# EAGLE design combined_breakout (EAGLE 6.5.0)
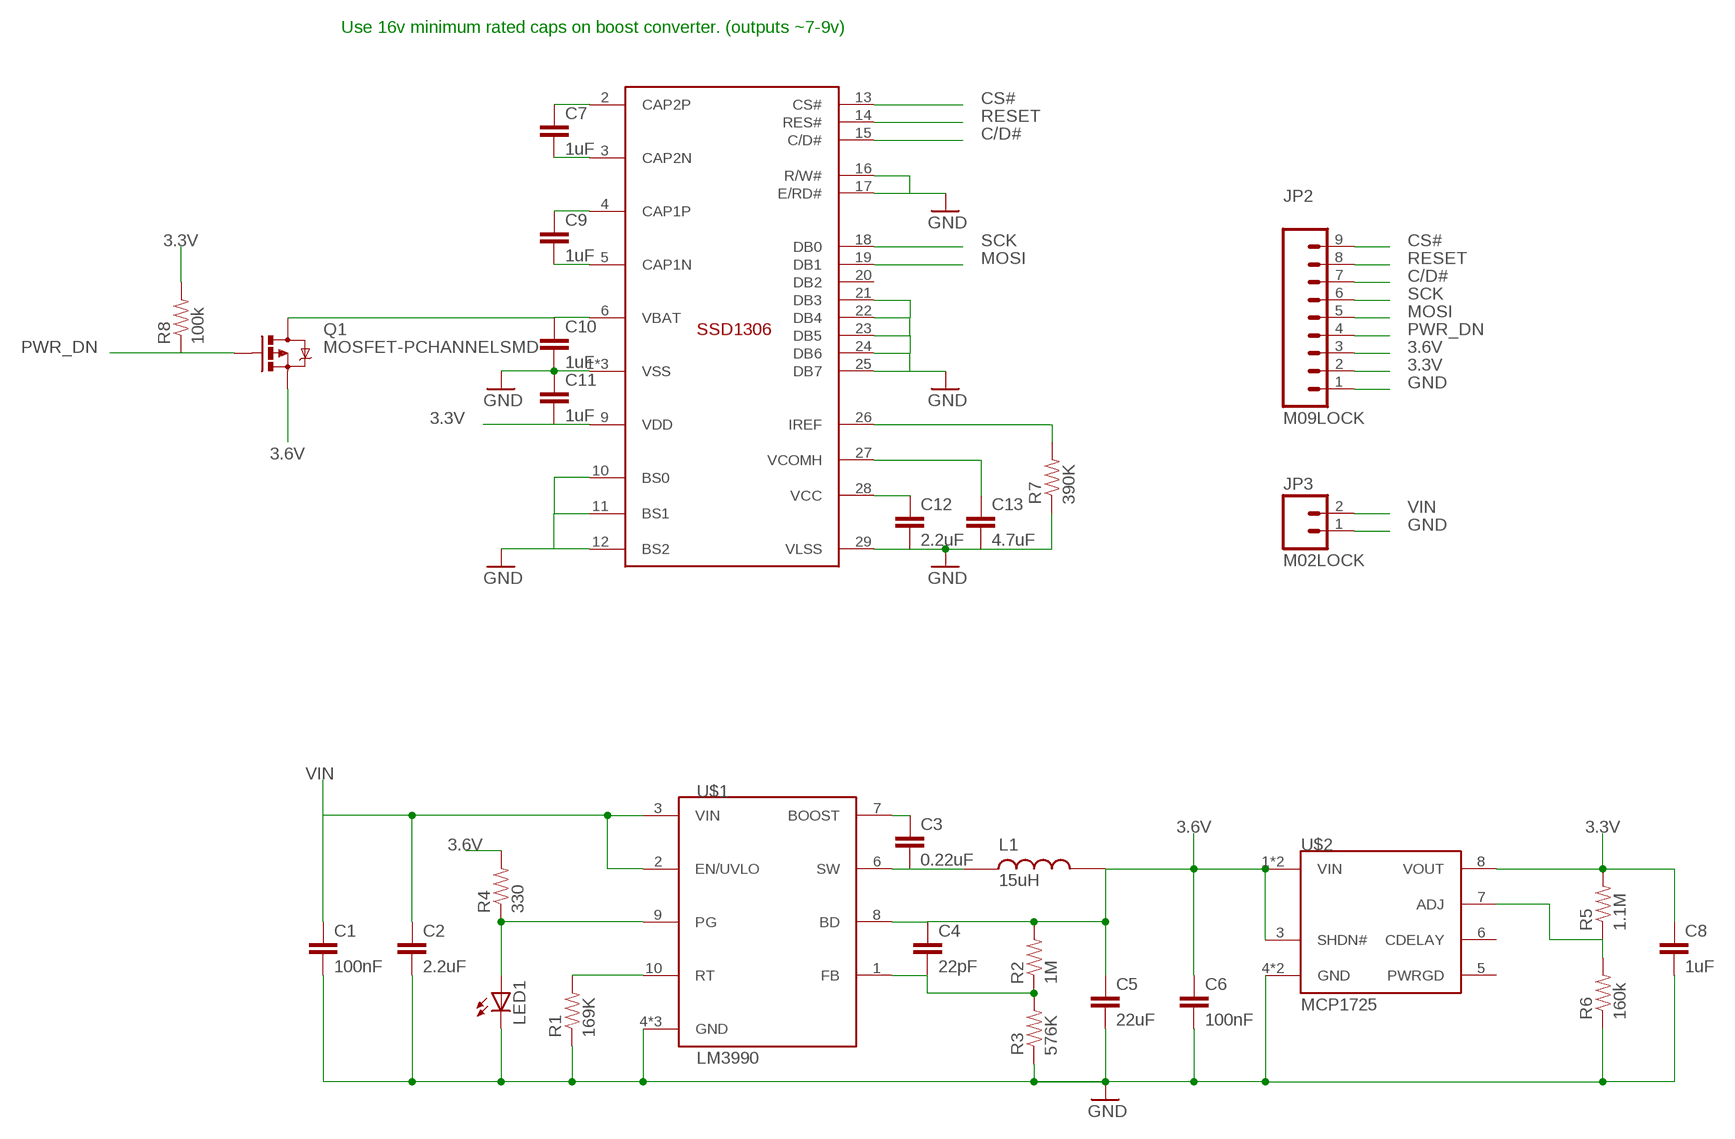
[diagram p0: schematic, sheet 1]

## Parts
C1  100nF  CAP0603-CAP  [0603-CAP]
C2  2.2uF  CAP1206  [1206]
C3  0.22uF  CAP0603-CAP  [0603-CAP]
C4  22pF  CAP0603-CAP  [0603-CAP]
C5  22uF  CAP1206  [1206]
C6  100nF  CAP0603-CAP  [0603-CAP]
C7  1uF  CAP0402-S  [0402-S]
C8  1uF  CAP0603-CAP  [0603-CAP]
C9  1uF  CAP0402-S  [0402-S]
C10  1uF  CAP0402-S  [0402-S]
C11  1uF  CAP0402-S  [0402-S]
C12  2.2uF  CAP0402-S  [0402-S]
C13  4.7uF  CAP0402-S  [0402-S]
JP2  M09LOCK  [1X09_LOCK]
JP3  M02LOCK  [1X02_LOCK]
L1  15uH  NR6028T150M  [NR6028T150M]
LED1  LED0603  [LED-0603]
Q1  MOSFET-PCHANNELSMD  [SOT23-3]
R1  169K  RESISTOR0402-S  [0402-S]
R2  1M  RESISTOR0402-S  [0402-S]
R3  576K  RESISTOR0402-S  [0402-S]
R4  330  RESISTOR0402-S  [0402-S]
R5  1.1M  RESISTOR0402-S  [0402-S]
R6  160k  RESISTOR0402-S  [0402-S]
R7  390K  RESISTOR0402-S  [0402-S]
R8  100k  RESISTOR0402-S  [0402-S]
U$1  LM3990  [DD10]
U$2  MCP1725  [2X3_DFN]
U$3  ER-OLED0.96-2  [ER-OLED0.96-2]

## Nets
3.3V: C8.1 C11.2 JP2.2 R5.2 R8.2 U$2.8(VOUT) U$3.9(VDD)
3.6V: C4.1 C5.1 C6.1 JP2.3 L1.2 Q1.2(S) R2.2 R4.2 U$1.8(BD) U$2.1(VIN) U$2.2(VIN) U$2.3(SHDN#)
C/D#: JP2.7 U$3.15(C/D#)
CS#: JP2.9 U$3.13(CS#)
FB: C4.2 R2.1 R3.2 U$1.1(FB)
GND: C1.2 C2.2 C5.2 C6.2 C8.2 C10.2 C11.1 C12.2 C13.2 JP2.1 JP3.1 LED1.C R1.1 R3.1 R6.1 R7.1 U$1.4(GND) U$1.5(GND) U$1.EP\(GND) U$2.4(GND) U$2.EP(GND) U$3.1(VSS) U$3.8(VSS) U$3.10(BS0) U$3.11(BS1) U$3.12(BS2) U$3.16(R/W#) U$3.17(E/RD#) U$3.21(DB3) U$3.22(DB4) U$3.23(DB5) U$3.24(DB6) U$3.25(DB7) U$3.29(VLSS) U$3.30(VSS)
MOSI: JP2.5 U$3.19(DB1)
N$1: C12.1 U$3.28(VCC)
N$2: LED1.A R4.1 U$1.9(PG)
N$3: C13.1 U$3.27(VCOMH)
N$4: C3.1 U$1.7(BOOST)
N$5: R7.2 U$3.26(IREF)
N$6: R5.1 R6.2 U$2.7(ADJ)
N$7: R1.2 U$1.10(RT)
N$8: C9.1 U$3.4(CAP1P)
N$9: C9.2 U$3.5(CAP1N)
N$11: C7.2 U$3.3(CAP2N)
N$12: C7.1 U$3.2(CAP2P)
N$15: C10.1 Q1.3(D) U$3.6(VBAT)
PWR_DN: JP2.4 Q1.1(G) R8.1
RESET: JP2.8 U$3.14(RES#)
SCK: JP2.6 U$3.18(DB0)
SW: C3.2 L1.1 U$1.6(SW)
VIN: C1.1 C2.1 JP3.2 U$1.2(EN/UVLO) U$1.3(VIN)
Unconnected: U$2.5(PWRGD) U$2.6(CDELAY) U$3.20(DB2)

## Notes on the sheet
- Use 16v minimum rated caps on boost converter. (outputs ~7-9v)

## Library data of the parts
C1-C13 = chips:CAP: Capacitor Standard 0603 ceramic capacitor, and 0.1" leaded capacitor.
JP2 = SparkFun-Connectors:M09: Header 9 Standard 9-pin 0.1" header. Use with straight break away headers (SKU : PRT-00116), right angle break away headers (PRT-00553), swiss pins (PRT-00743), machine pins (PRT-00117), and female headers (PRT-00115).
JP3 = SparkFun-Connectors:M02: Standard 2-pin 0.1" header. Use with - straight break away headers ( PRT-00116) - right angle break away headers (PRT-00553) - swiss pins (PRT-00743) - machine pins (PRT-00117) - female headers (PRT-00115) Molex polarized connector foot print use with: PRT-08233 with associated crimp pins and housings. 2.54_SCREWTERM for use with PRT-10571. 3.5mm Screw Terminal footprints for PRT-08084 5mm Screw Terminal footprints for use with PRT-08433
L1 = brent:NR6028T150M
LED1 = chips:LED: LEDs Standard schematic elements and footprints for 5mm, 3mm, 1206, and 0603 sized LEDs. 5mm - Spark Fun Electronics SKU : COM-00529 (and others)
Q1 = chips:MOSFET-PCHANNEL
R1-R8 = chips:RESISTOR: Resistor Basic schematic elements and footprints for 0603, 1206, and PTH resistors.
U$1 = intelliDesk:LM3990
U$2 = intelliDesk:MCP1725
U$3 = intelliDesk:ER-OLED0.96-2

## Board
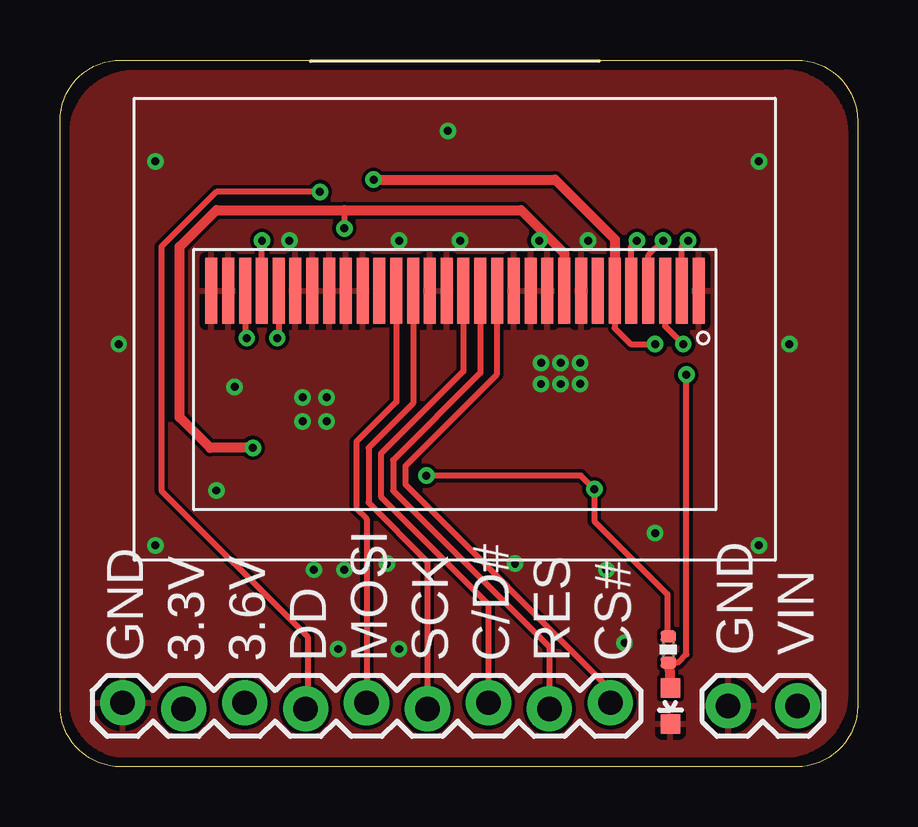
[diagram p1: board, top side]
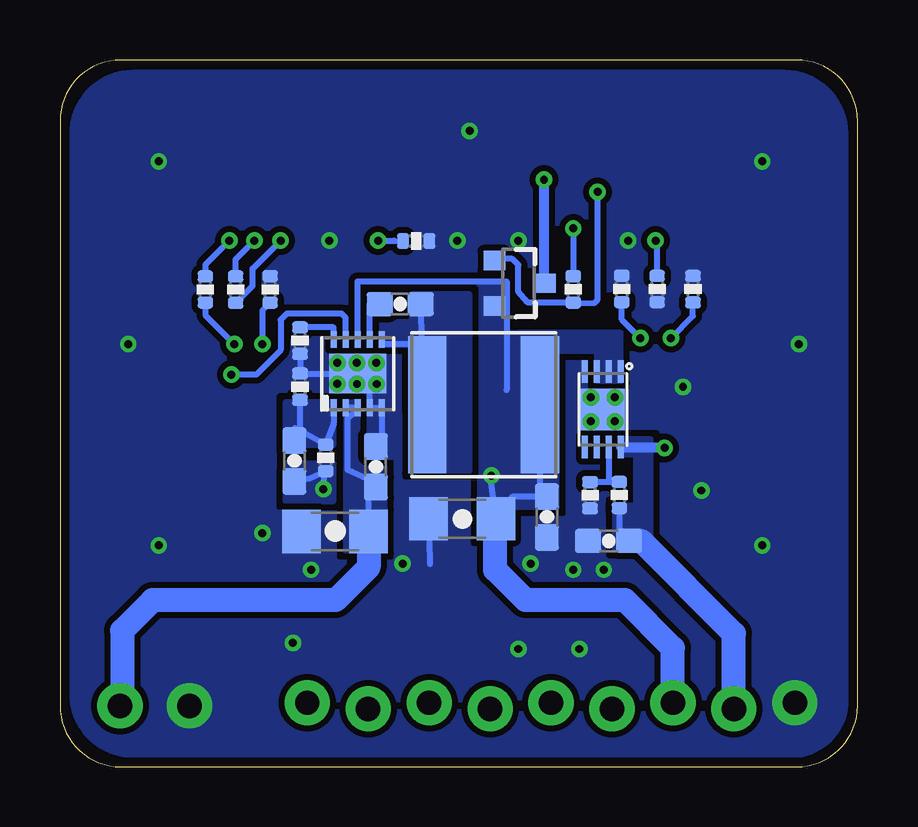
[diagram p2: board, bottom side, seen from below]

Size 33.23 x 29.45 mm. Coordinates in mm from the lower left corner, seen from the top.
Outline: 2.54,29.45 30.69,29.45 arc-90 33.23,26.91 33.23,2.54 arc-90 30.69,0 2.54,0 arc-90 0,2.54 0,26.91 arc-90 2.54,29.45
Copper layers (1*16): Top 0.0356mm / dielectric 1.5011mm / Bottom 0.0356mm
Design rules "LaenPCBOrder": minimum track width 6mil, minimum drill 13mil, track to track 6mil, track to pad 6mil, pad to pad 6mil, via to via 6mil, smd to smd 6mil, copper to edge 15mil, drill to drill 6mil, minimum pad ring 7mil, minimum via ring 7mil, stop-mask expansion 0mil, vias tented up to drill 13mil, thermal gap 10mil

### Footprints (pad centres in the part's own frame; a part is rotated, then mirrored left to right if it is on the bottom)
0603-CAP = smd 1.1 x 1: 1 -0.85,0; 2 0.85,0
1206 = smd 1.6 x 1.8: 1 -1.4,0; 2 1.4,0
0402-S = smd 0.5 x 0.65: 1 -0.55,0; 2 0.55,0
1X09_LOCK = drill 1.016 pad 1.88: 1 0,0.127; 2 2.54,-0.127; 3 5.08,0.127; 4 7.62,-0.127; 5 10.16,0.127; 6 12.7,-0.127; 7 15.24,0.127; 8 17.78,-0.127; 9 20.32,0.127
1X02_LOCK = drill 1.016 pad 1.88: 1 -0.178,0; 2 2.718,0
NR6028T150M = smd 1.6 x 5.7: 1 -2.35,0; 2 2.35,0
LED-0603 = smd 0.8 x 0.8: A 0,-0.75; C 0,0.75
SOT23-3 = smd 0.8 x 0.9: 1 -0.95,-1; 2 0.95,-1; 3 0,1.1
DD10 = smd 0.25 x 0.7: 1 -1,-1.425; 2 -0.5,-1.425; 3 0,-1.425; 4 0.5,-1.425; 5 1,-1.425; 6 1,1.425; 7 0.5,1.425; 8 0,1.425; 9 -0.5,1.425; 10 -1,1.425 | smd 2.38 x 1.65: EP\ 0,0
2X3_DFN = smd 0.94 x 0.25: 1 -1.57,0.75; 2 -1.57,0.25; 3 -1.57,-0.25; 4 -1.57,-0.75; 5 1.57,-0.75; 6 1.57,-0.25; 7 1.57,0.25; 8 1.57,0.75 | smd 1.72 x 1.84: EP 0,0
ER-OLED0.96-2 = smd 0.5 x 2.75: 1 0,0; 2 0.7,0; 3 1.4,0; 4 2.1,0; 5 2.8,0; 6 3.5,0; 7 4.2,0; 8 4.9,0; 9 5.6,0; 10 6.3,0; 11 7,0; 12 7.7,0; 13 8.4,0; 14 9.1,0; 15 9.8,0; 16 10.5,0; 17 11.2,0; 18 11.9,0; 19 12.6,0; 20 13.3,0; 21 14,0; 22 14.7,0; 23 15.4,0; 24 16.1,0; 25 16.8,0; 26 17.5,0; 27 18.2,0; 28 18.9,0; 29 19.6,0; 30 20.3,0

### Placement (x,y rotation side)
C1  20.07,12.5 90 bottom
C2  21.77,9.8 180 bottom
C3  19.06,19.27 0 bottom
C4  23.46,12.74 90 bottom
C5  16.47,10.34 180 bottom
C6  12.94,10.41 270 bottom
C7  27.18,19.89 270 bottom
C8  10.37,9.41 180 bottom
C9  25.92,19.88 270 bottom
C10  24.48,19.89 90 bottom
C11  18.39,21.91 180 bottom
C12  6.86,19.91 90 bottom
C13  8.35,19.91 270 bottom
JP2  2.61,2.54 0 top
JP3  28.01,2.54 0 top
L1  15.58,15.08 0 bottom
LED1  25.43,2.53 180 top
Q1  14.13,20.15 270 bottom
R1  23.23,17.76 90 bottom
R2  22.16,12.87 270 bottom
R3  23.23,15.84 270 bottom
R4  25.35,4.89 90 top
R5  9.92,11.32 270 bottom
R6  11.15,11.31 90 bottom
R7  9.82,19.91 270 bottom
R8  11.85,19.89 90 bottom
U$1  20.83,16.38 0 bottom
U$2  10.61,14.89 270 bottom
U$3  26.61,19.83 180 top

### Tracks (layer width: path | path; a pad name or v marks a point on that pad's centre or on a via)
3.3V  (via drill 0.33)
  Top 0.254: 21.01,21.4 20.48,21.93 v19.97,21.93 | 11.85,23.2 v11.85,22.43
  Top 0.406: v8.04,13.29 6.26,13.29 4.99,14.56 4.99,21.67 6.51,23.2 11.85,23.2 19.21,23.2 21.01,21.4 U$3.9
  Bottom 0.25: R5.2 9.92,9.92 C8.1
  Bottom 0.254: v19.97,21.93 19.31,21.93 C11.2 | v11.85,22.43 R8.2
  Bottom 0.406: U$2.8 8.07,13.32 v8.04,13.29
  Bottom 1: JP2.2 5.15,5.55 9.02,9.41 C8.1
  pour Bottom (no thermals): 9.86,13.64 9.86,13.02 9.24,13.02 9.24,10.88 10.11,10.88 10.11,9.07 8.61,9.07 8.61,13.64
3.6V  (via drill 0.33)
  Top 0.254: R4.2 25.31,5.48 25.31,7.19 22.26,10.24 v22.26,11.57 21.7,12.13 v15.26,12.13
  Bottom 0.25: 13.23,11.32 L1.2 | 23.09,12.01 C4.1 22.84,12.01 R2.2 22.21,12.08 v22.26,11.57 | C6.1 14.38,11.25 C5.1 15.27,11.87 v15.26,12.13 | 14.62,15.71 14.62,20.23 20.83,20.23 U$1.8
  Bottom 0.254: 15.1,8.21 14.64,7.75 14.64,7.45
  Bottom 1: C5.1 15.1,10.31 15.1,8.21 13.83,6.94 9.69,6.94 7.69,4.94 JP2.3
  pour Bottom (isolate 0.25, rank 2, no thermals): 14.56,10.83 12.53,10.83 12.53,18.08 14.62,18.06 14.62,20.18 15.76,20.18 15.74,9.56 14.56,9.58
  pour Bottom (isolate 0.25, no thermals): 21.83,12.63 23.83,12.62 23.84,11.07 21.83,11.07
  pour Bottom (no thermals): 10.86,16.08 9.86,16.08 9.86,18.08 14.11,18.08 14.11,17.33 10.86,17.33
C/D#
  Top 0.254: U$3.15 16.81,16.48 13.37,13.04 13.37,11.26 17.85,6.78 JP2.7
CS#
  Top 0.254: U$3.13 18.2,19.81 18.2,16.34 14.39,12.53 14.39,11.77 22.93,3.22 JP2.9
FB
  Bottom 0.25: R3.2 23.23,14.13 23.26,14.13 C4.2 23.44,14.12 R2.1 21.83,14.32 U$1.1
  pour Bottom (isolate 0.25, rank 2, no thermals): 21.83,15.18 23.84,15.18 23.84,13.42 21.83,13.42
GND  (via drill 0.33)
  Bottom 0.25: R1.1 R3.1 23.09,16.38 U$1.EP\ 20.33,16.38 U$1.4 U$1.5 19.83,13.84 C1.2 | C5.2 17.82,8.45
  other vias: 10.11,14.39 11.11,14.39 11.11,15.39 10.11,15.39 20.04,15.95 20.86,15.95 21.67,15.95 21.67,16.83 20.86,16.83 20.05,16.83 22.01,21.93 16.67,21.93 10.58,8.21 11.85,8.21 13.62,8.46 14.13,21.93 9.56,21.93 7.27,15.83 6.51,11.51 11.59,4.91 14.13,4.91 3.97,9.23 2.45,17.61 3.97,25.23 16.16,26.5 29.12,25.23 30.39,17.61 29.12,9.23 24.8,9.73 22.77,8.21 18.96,8.46 23.53,5.16
  pour Bottom (isolate 0.25, rank 5, no thermals): 0.5,3.04 0.5,26.37 arc-90 3.04,28.91 30.19,28.91 arc-90 32.73,26.37 32.73,3.04 arc-90 30.19,0.5 2.53,0.5 arc-90
  pour Top: 2.53,0.5 30.19,0.5 arc90 32.73,3.05 32.74,26.38 arc90 30.19,28.92 3.03,28.9 arc90 0.5,26.36 0.5,3.04 arc90
MOSI
  Top 0.254: U$3.19 14.01,15.2 12.35,13.54 12.35,10.75 12.77,10.33 JP2.5
N$1  (via drill 0.33)
  Top 0.254: U$3.28 7.71,17.93 v7.78,17.86
  Bottom 0.254: v7.78,17.86 6.86,18.79 C12.1
N$2  (via drill 0.33)
  Top 0.254: R4.1 25.75,4.34 26.09,4.68 v26.09,16.34
  Top 0.406: R4.1 25.41,3.93 LED1.A
  Bottom 0.254: U$1.9 21.33,18.71 21.5,18.88 23.78,18.88 24.04,18.62 24.04,17.35 25.05,16.34 v26.09,16.34
N$3  (via drill 0.33)
  Top 0.254: U$3.27 8.41,21.67 | 8.41,21.67 8.41,21.87 v8.42,21.93 8.42,21.68 8.41,21.67
  Bottom 0.254: C13.1 8.35,21.81 v8.42,21.93
N$4
  Bottom 0.25: U$1.7 20.33,19.27 C3.1
N$5  (via drill 0.33)
  Top 0.254: U$3.26 9.11,17.92 v9.05,17.86
  Bottom 0.254: v9.05,17.86 9.82,18.63 R7.2
N$6
  Bottom 0.254: U$2.7 10.36,11.87 R5.1 R6.2
N$7
  Bottom 0.25: U$1.10 21.83,18.31 R1.2
N$8  (via drill 0.33)
  Top 0.254: U$3.4 24.51,21.31 v25.13,21.93
  Bottom 0.254: C9.1 25.92,21.14 v25.13,21.93
N$9  (via drill 0.33)
  Top 0.254: U$3.5 23.81,21.7 v24.04,21.93
  Bottom 0.254: C9.2 25.21,20.04 25.21,20.76 v24.04,21.93
N$11  (via drill 0.33)
  Top 0.254: U$3.3 25.21,18.36 v25.97,17.61
  Bottom 0.254: C7.2 27.18,18.81 v25.97,17.61
N$12  (via drill 0.33)
  Top 0.254: U$3.2 25.91,21.67 v26.17,21.93
  Bottom 0.254: v26.17,21.93 27.18,20.92 C7.1
N$15  (via drill 0.33)
  Top 0.254: 23.12,19.84 U$3.6 23.11,18.28 23.78,17.61 v24.8,17.61
  Top 0.406: v13.06,24.47 20.63,24.47 23.12,21.98 23.12,19.84
  Bottom 0.254: C10.1 24.8,19.02 v24.8,17.61 | Q1.3 13.05,20.17 13.05,20.34
  Bottom 0.406: 13.05,20.34 v13.06,24.47
PWR_DN  (via drill 0.33)
  Top 0.254: v10.83,23.96 6.51,23.96 4.23,21.67 4.23,11.51 10.32,5.42 10.32,2.5 JP2.4
  Bottom 0.254: v10.83,23.96 10.83,19.46 10.97,19.32 R8.1 13.74,19.35 14.13,19.79 14.13,20.91 14.39,21.16 15.07,21.16 Q1.1
RESET
  Top 0.254: U$3.14 17.51,16.42 13.88,12.78 13.88,11.51 20.39,5 JP2.8
SCK
  Top 0.254: U$3.18 14.71,15.14 12.86,13.29 12.86,11 15.31,8.55 JP2.6
SW
  Bottom 0.25: U$1.6 19.83,17.63 18.19,17.63 | L1.1 17.86,15.08 17.86,17.23 18.06,17.23 18.06,17.63 18.19,17.63 | C3.2 18.19,17.63
  pour Bottom (isolate 0.25, no thermals): 19.83,17.59 18.61,17.58 18.6,12.35 16.16,12.35 16.16,19.68 18.57,19.68 18.57,18.53 19.83,18.54
VIN
  Bottom 0.25: U$1.2 U$1.3 20.83,14.86 21.26,14.53 21.26,12.38 21.08,12.3 20.61,12.08 20.07,12.08 C1.1 20.37,11.78 C2.1
  Bottom 1: C2.1 20.37,8.32 21.75,6.94 29.37,6.94 30.64,5.67 30.64,2.63 JP3.2
  pour Bottom (isolate 0.25, rank 2, no thermals): 20.83,15.18 21.33,15.18 21.33,9.02 19.69,9.02 19.69,12.59 20.83,12.59

### Text on the board
tSilk: GND | VIN | GND | 3.3V | 3.6V | DD | MOSI | SCK | C/D# | RES | CS#